# Altium project PCB_Project1.PrjPCB
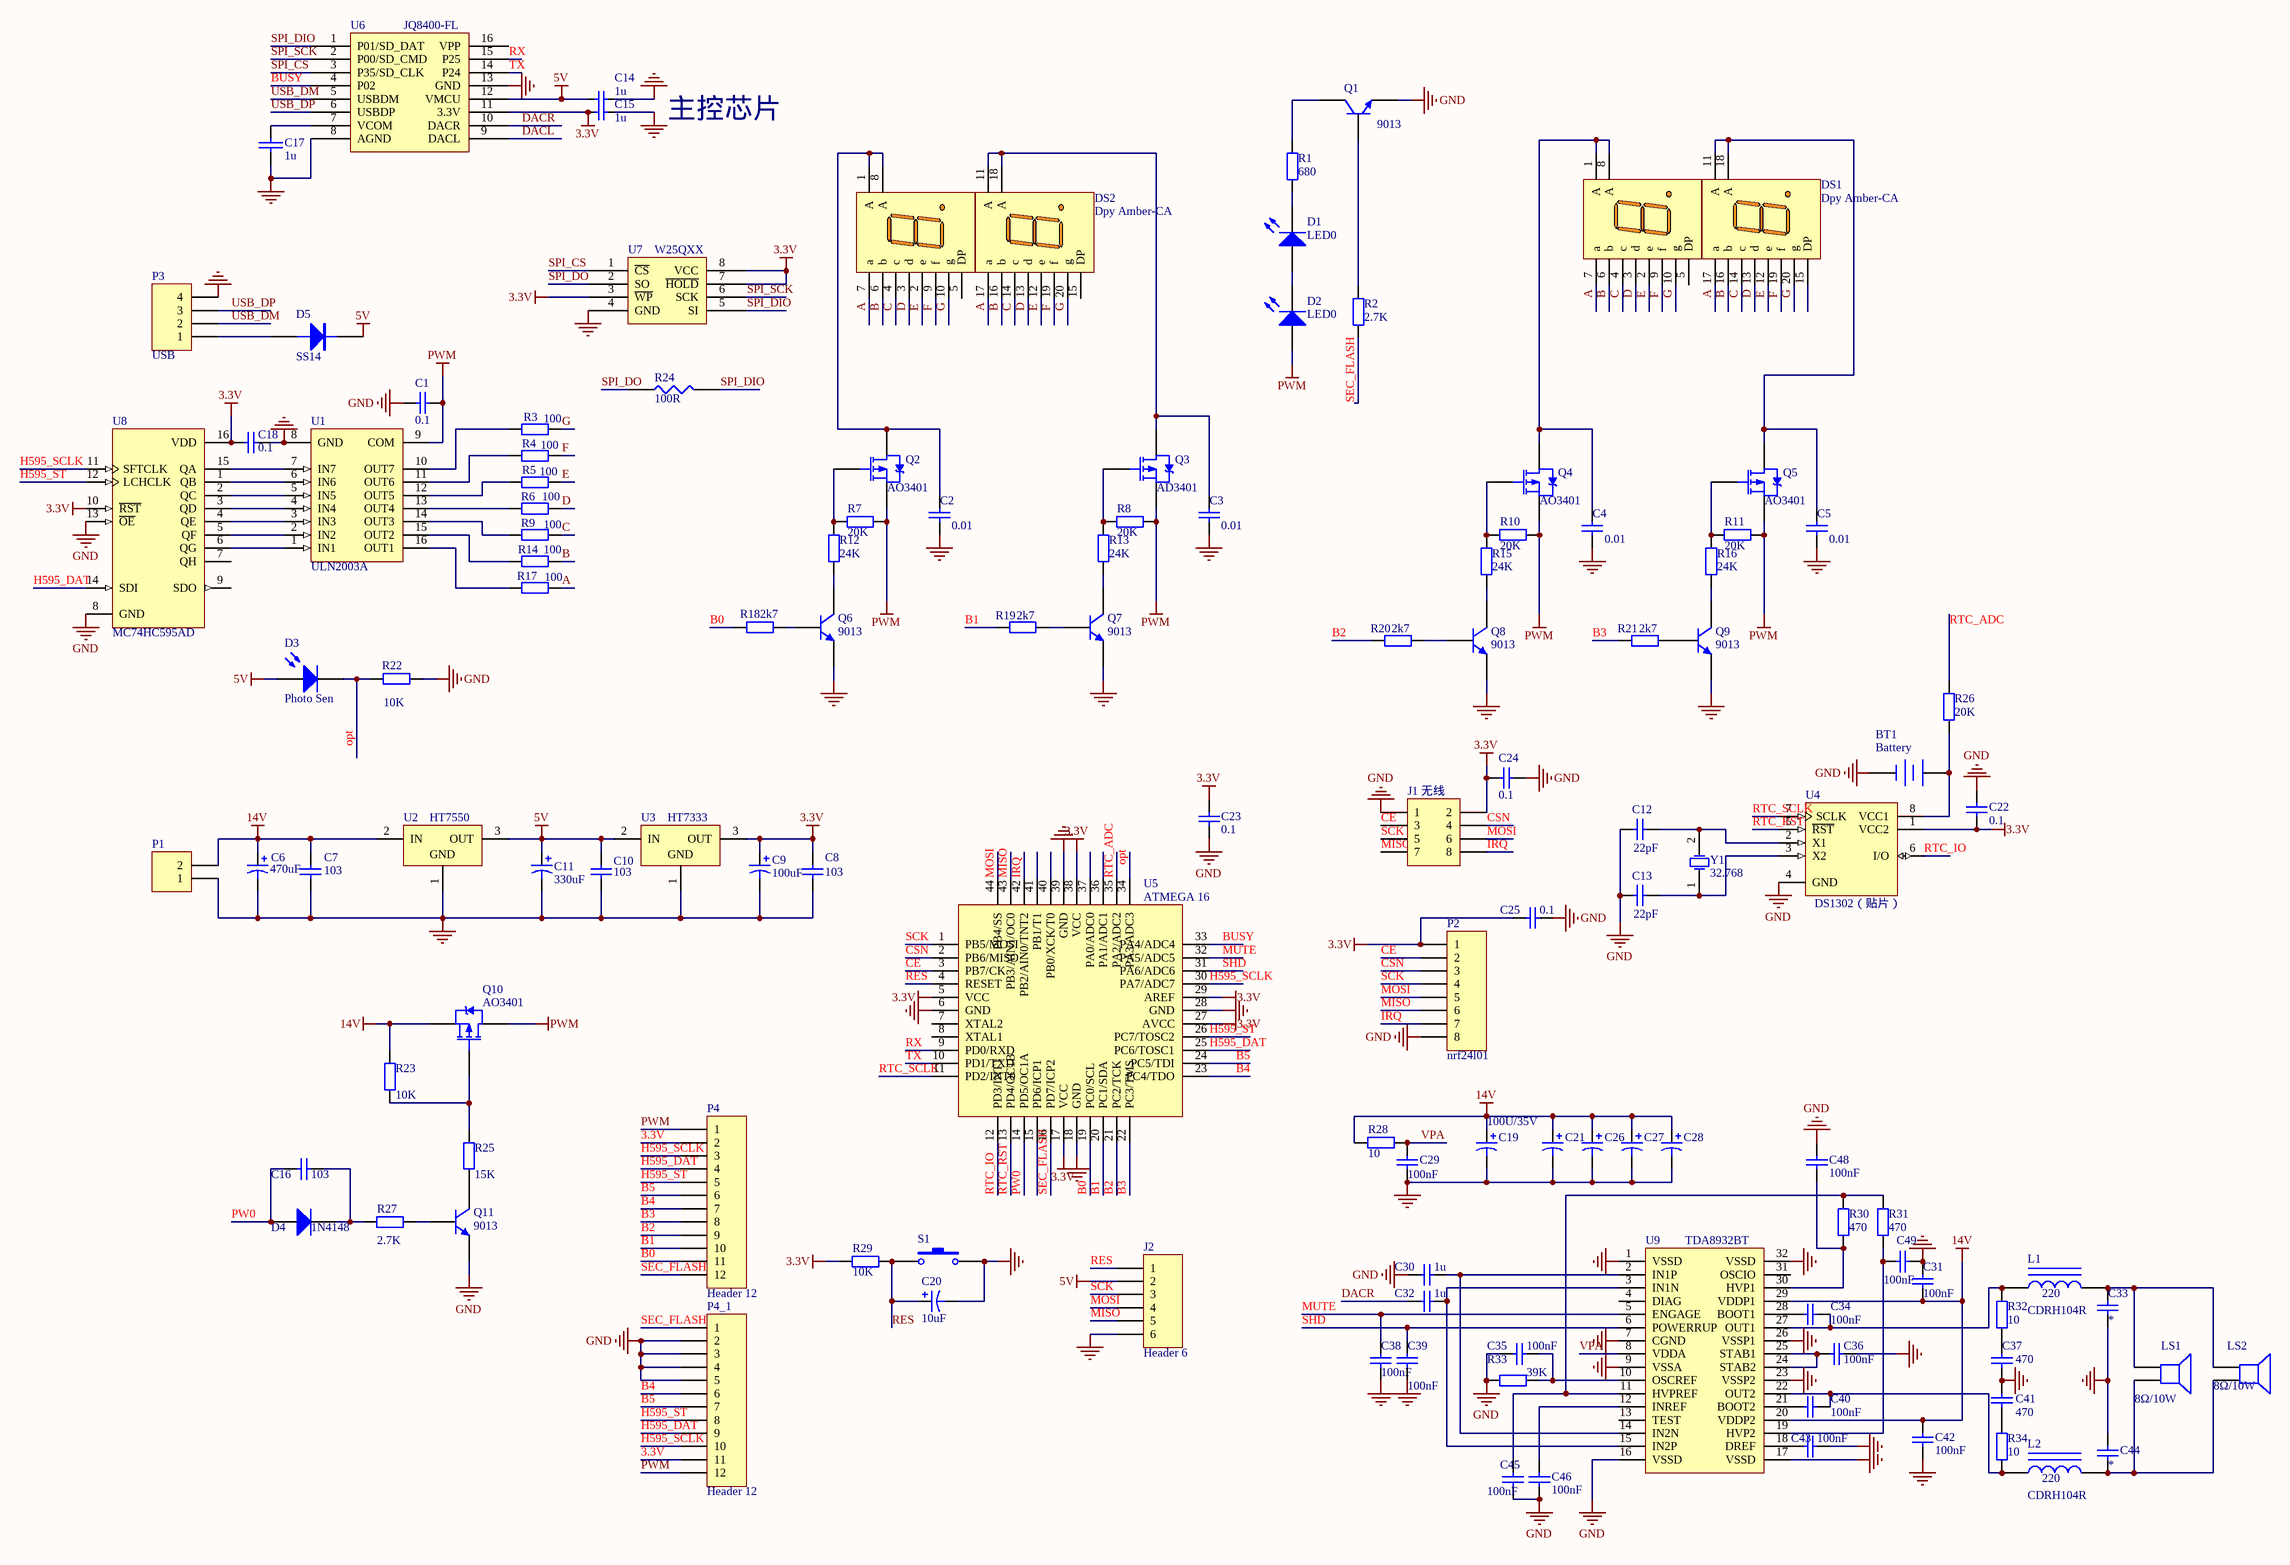
[diagram p0: Sheet1.SchDoc]
1 sheet, 123 parts. Net scope: global (net labels, ports and power ports of the same name join across sheets).
Board file: PCB1.PcbDoc

## Sheet Sheet1.SchDoc
size A2; PageSetup: Record=PageOptions|CenterHorizontal=True|CenterVertical=True|PrintScale=0.50|XCorrection=1.00|YCorrection=1.00|PrintKind=2|BorderSize=5000000|LeftOffset=0|BottomOffset=0|Orientation=2|PaperLength=1000|PaperWidth=1000|Scale=100|PaperSource=7|PrintQuality=-4|MediaType=1|DitherType=10|PaperKind=A4|PrintScaleMode=1

### Parts
BT1  Battery  [1220电池底座]
C1  0.1  [0805]
C2  value 0.01  [0805]  (hidden comment: 0.1)
C3  value 0.01  [0805]  (hidden comment: 0.1)
C4  value 0.01  [0805]  (hidden comment: 0.1)
C5  value 0.01  [0805]  (hidden comment: 0.1)
C6  value 470uF  [470uf35V贴片]  (hidden comment: Cap Pol1)
C7  value 103  [0805]  (hidden comment: Cap Semi)
C8  value 103  [0805]  (hidden comment: Cap Semi)
C9  value 100uF  [1206]  (hidden comment: Cap Pol1)
C10  value 103  [0805]  (hidden comment: Cap Semi)
C11  value 330uF  [220uf16V贴片]  (hidden comment: Cap Pol1)
C12  value 22pF  [0805]  (hidden comment: Cap)
C13  value 22pF  [0805]  (hidden comment: Cap)
C14  1u  [0805]
C15  1u  [0805]
C16  value 103  [0805]  (hidden comment: Cap Semi)
C17  1u  [0805]
C18  0.1  [0805]
C19  100U/35V  [220uf16V贴片]
C20  value 10uF  [1206]
C21  Cap Pol1  [220uf16V贴片]  (value not drawn)
C22  0.1  [0805]
C23  0.1  [0805]
C24  0.1  [0805]
C25  0.1  [0805]
C26  Cap Pol1  [220uf16V贴片]  (value not drawn)
C27  Cap Pol1  [220uf16V贴片]  (value not drawn)
C28  Cap Pol1  [220uf16V贴片]  (value not drawn)
C29  value 100nF  [0603]  (hidden comment: 0.1)
C30  value 1u  [0603]  (hidden comment: 0.1)
C31  value 100nF  [0603]  (hidden comment: 0.1)
C32  value 1u  [0603]  (hidden comment: 0.1)
C33  0.1  [0805]  (value not drawn)
C34  value 100nF  [0603]  (hidden comment: 0.1)
C35  value 100nF  [0603]  (hidden comment: 0.1)
C36  value 100nF  [0603]  (hidden comment: 0.1)
C37  value 470  [0603]  (hidden comment: 0.1)
C38  value 100nF  [0603]  (hidden comment: 0.1)
C39  value 100nF  [0603]  (hidden comment: 0.1)
C40  value 100nF  [0603]  (hidden comment: 0.1)
C41  value 470  [0603]  (hidden comment: 0.1)
C42  value 100nF  [0603]  (hidden comment: 0.1)
C43  value 100nF  [0603]  (hidden comment: 0.1)
C44  0.1  [0805]  (value not drawn)
C45  value 100nF  [0603]  (hidden comment: 0.1)
C46  value 100nF  [0603]  (hidden comment: 0.1)
C48  value 100nF  [0603]  (hidden comment: 0.1)
C49  value 100nF  [0603]  (hidden comment: 0.1)
D1  LED0  [led]
D2  LED0  [led]
D3  Photo Sen  [2排针]
D4  1N4148  [1206]
D5  SS14  [1206]
DS1  Dpy Amber-CA  [5英寸数码管]
DS2  Dpy Amber-CA  [5英寸数码管]
J1  无线  [无线模块]
J2  Header 6  [HDR1X6]
L1  220  value CDRH104R  [CDRH104]
L2  220  value CDRH104R  [CDRH104]
LS1  8Ω/10W  [2排针]
LS2  8Ω/10W  [2排针]
P1  Header 2  [电源插头]  (value not drawn)
P2  nrf24l01  [24L01]
P3  USB  [HDR1X4]
P4  Header 12  [FPC-12P1MM]
P4_1  Header 12  [FPC-12P1MM]
Q1  9013  [9013贴片（专用）]
Q2  AO3401  [SOP-23]
Q3  AD3401  [SOP-23]
Q4  AO3401  [SOP-23]
Q5  AO3401  [SOP-23]
Q6  9013  [9013贴片（专用）]
Q7  9013  [9013贴片（专用）]
Q8  9013  [9013贴片（专用）]
Q9  9013  [9013贴片（专用）]
Q10  AO3401  [SOP-23]
Q11  9013  [9013贴片（专用）]
R1  value 680  [0805]  (hidden comment: Res2)
R2  value 2.7K  [0805]  (hidden comment: Res2)
R3  100  [0805]
R4  100  [0805]
R5  100  [0805]
R6  100  [0805]
R7  20K  [0805]
R8  20K  [0805]
R9  100  [0805]
R10  20K  [0805]
R11  20K  [0805]
R12  24K  [0805]
R13  24K  [0603]
R14  100  [0805]
R15  24K  [0805]
R16  24K  [0805]
R17  100  [0805]
R18  2k7  [0805]
R19  2k7  [0805]
R20  2k7  [0805]
R21  2k7  [0805]
R22  value 10K  [0805]
R23  value 10K  [0805]  (hidden comment: Res2)
R24  100R
R25  value 15K  [0805]  (hidden comment: Res2)
R26  20K  [0805]
R27  value 2.7K  [0805]  (hidden comment: Res2)
R28  10  [0805]
R29  value 10K  [0805]
R30  470  [0603]
R31  470  [0603]
R32  10  [0603]
R33  39K  [0603]
R34  10  [0603]
S1  (no value)  [4脚按键]
U1  ULN2003A  [SO-16]
U2  HT7550  [SOT89L]
U3  HT7333  [SOT89L]
U4  DS1302（贴片）  [SOP8（DS1302）]
U5  ATMEGA 16  [44贴片（顶层）]
U6  JQ8400-FL  [SO-16]
U7  W25QXX  [w25]
U8  MC74HC595AD  [751B-05_N]
U9  TDA8932BT  [SOIC127P1047-32L]
Y1  32.768  [32K]

### Nets
3.3V: C8.2 C9.1 C15.1 C18.2 C22.1 C23.1 C24.1 C25.1 J1.2 P2.1 P4.2 P4_1.11 R29.1 U3.3(OUT) U4.1(VCC2) U5.5(VCC) U5.17(VCC) U5.27(AVCC) U5.29(AREF) U5.38(VCC) U6.11(3.3V) U7.3(~{WP}) U7.7(~{HOLD}) U7.8(VCC) U8.10(~{RST}) U8.16(VDD)
5V: C10.2 C11.1 C14.1 D3.1(A) D5.2(K) J2.2 U2.3(OUT) U3.2(IN) U6.12(VMCU)
14V: C6.1 C7.2 C19.1 C21.1 C26.1 C27.1 C28.1 C31.1 C42.1 P1.2 Q10.3(S) R23.2 R28.1 U2.2(IN) U9.20(VDDP2) U9.29(VDDP1)
GND: BT1.2(-) C1.2 C2.1 C3.1 C4.1 C5.1 C6.2 C7.1 C8.1 C9.2 C10.1 C11.2 C12.1 C13.1 C14.2 C15.2 C17.2 C18.1 C19.2 C20.2 C21.2 C22.2 C23.2 C24.2 C25.2 C26.2 C27.2 C28.2 C29.1 C30.1 C31.2 C33.2 C35.1 C36.1 C37.2 C38.1 C39.1 C41.2 C42.2 C43.1 C44.1 C45.1 C46.1 C48.2 C49.1 J1.1 J2.6 P1.1 P2.8 P3.4 P4_1.2 P4_1.3 P4_1.4 P4_1.5 Q1.1(E) Q6.2(E) Q7.2(E) Q8.2(E) Q9.2(E) Q11.1(E) R22.1 R33.2 S1.2 U1.8(GND) U2.1(GND) U3.1(GND) U4.4(GND) U5.6(GND) U5.18(GND) U5.28(GND) U5.39(GND) U6.8(AGND) U6.13(GND) U7.4(GND) U8.8(GND) U8.13(~{OE}) U9.1(VSSD) U9.7(CGND) U9.9(VSSA) U9.16(VSSD) U9.17(VSSD) U9.23(VSSP2) U9.26(VSSP1) U9.32(VSSD)
PWM: C1.1 D2.1(A) P4.1 P4_1.12 Q2.2(S) Q3.2(S) Q4.2(S) Q5.2(S) Q10.2(D) R7.1 R8.1 R10.1 R11.1 U1.9(COM)
A: DS1.7(a) DS1.17(a) DS2.7(a) DS2.17(a) R17.1
B: DS1.6(b) DS1.16(b) DS2.6(b) DS2.16(b) R14.1
B0: P4.11 R18.2 U5.19(PC0/SCL)
B1: P4.10 R19.2 U5.20(PC1/SDA)
B2: P4.9 R20.2 U5.21(PC2/TCK)
B3: P4.8 R21.2 U5.22(PC3/TMS)
B4: P4.7 P4_1.6 U5.23(PC4/TDO)
B5: P4.6 P4_1.7 U5.24(PC5/TDI)
BUSY: U5.33(PA4/ADC4) U6.4(P02)
C: DS1.4(c) DS1.14(c) DS2.4(c) DS2.14(c) R9.1
CE: J1.3 P2.2 U5.3(PB7/CK)
CSN: J1.4 P2.3 U5.2(PB6/MISO)
D: DS1.3(d) DS1.13(d) DS2.3(d) DS2.13(d) R6.1
DACL: U6.9(DACL)
DACR: C32.1 U6.10(DACR)
E: DS1.2(e) DS1.12(e) DS2.2(e) DS2.12(e) R5.1
F: DS1.9(f) DS1.19(f) DS2.9(f) DS2.19(f) R4.1
G: DS1.10(g) DS1.20(g) DS2.10(g) DS2.20(g) R3.1
H595_DAT: P4.4 P4_1.9 U5.25(PC6/TOSC1) U8.14(SDI)
H595_SCLK: P4.3 P4_1.10 U5.30(PA7/ADC7) U8.11(SFTCLK)
H595_ST: P4.5 P4_1.8 U5.26(PC7/TOSC2) U8.12(LCHCLK)
IRQ: J1.8 P2.7 U5.42(PB2/AIN0/TNT2)
MISO: J1.7 J2.5 P2.6 U5.43(PB3/AIN1/OC0)
MOSI: J1.6 J2.4 P2.5 U5.44(PB4/SS)
MUTE: C38.2 U5.32(PA5/ADC5) U9.5(ENGAGE)
opt: D3.2(K) R22.2 U5.34(PA3/ADC3)
PW0: C16.2 D4.1(A) U5.14(PD5/OC1A)
RES: C20.1 J2.1 R29.2 S1.1 U5.4(RESET)
RTC_ADC: R26.1 U5.35(PA2/ADC2)
RTC_IO: U4.6(I/O) U5.12(PD3/INT1)
RTC_RST: U4.5(~{RST}) U5.13(PD4/OC1B)
RTC_SCLK: U4.7(SCLK) U5.11(PD2/INT0)
RX: U5.9(PD0/RXD) U6.15(P25)
SCK: J1.5 J2.3 P2.4 U5.1(PB5/MOSI)
SEC_FLASH: P4.12 P4_1.1 R2.1 U5.16(PD7/ICP2)
SHD: C39.2 U5.31(PA6/ADC6) U9.6(POWERRUP)
SPI_CS: U6.3(P35/SD_CLK) U7.1(~{CS})
SPI_DIO: R24.2 U6.1(P01/SD_DAT) U7.5(SI)
SPI_DO: R24.1 U7.2(SO)
SPI_SCK: U6.2(P00/SD_CMD) U7.6(SCK)
TX: U5.10(PD1/TXD) U6.14(P24)
USB_DM: P3.2 U6.5(USBDM)
USB_DP: P3.3 U6.6(USBDP)
VPA: C29.2 R28.2 U9.8(VDDA)
NetBT1_1: BT1.1(+) R26.2 U4.8(VCC1)
NetC2_2: C2.2 DS2.1(A) DS2.8(A) Q2.3(D)
NetC3_2: C3.2 DS2.11(A) DS2.18(A) Q3.3(D)
NetC4_2: C4.2 DS1.1(A) DS1.8(A) Q4.3(D)
NetC5_2: C5.2 DS1.11(A) DS1.18(A) Q5.3(D)
NetC12_2: C12.2 U4.2(X1) Y1.2(OSC2)
NetC13_2: C13.2 U4.3(X2) Y1.1(OSC1)
NetC16_1: C16.1 D4.2(K) R27.2
NetC17_1: C17.1 U6.7(VCOM)
NetC30_2: C30.2 U9.2(IN1P) U9.14(IN2N)
NetC32_2: C32.2 U9.3(IN1N) U9.15(IN2P)
NetC33_1: C33.1 L1.2 LS1.1 LS2.2
NetC34_1: C34.1 L1.1 R32.1 U9.27(OUT1)
NetC34_2: C34.2 U9.28(BOOT1)
NetC35_2: C35.2 R33.1 U9.10(OSCREF)
NetC36_2: C36.2 U9.24(STAB2) U9.25(STAB1)
NetC37_1: C37.1 R32.2
NetC40_1: C40.1 L2.1 R34.1 U9.22(OUT2)
NetC40_2: C40.2 U9.21(BOOT2)
NetC41_1: C41.1 R34.2
NetC43_2: C43.2 U9.18(DREF)
NetC44_2: C44.2 L2.2 LS1.2 LS2.1
NetC45_2: C45.2 R30.1 R31.1 U9.11(HVPREF)
NetC46_2: C46.2 U9.12(INREF)
NetC48_1: C48.1 R30.2 U9.30(HVP1)
NetC49_2: C49.2 R31.2 U9.19(HVP2)
NetD1_1: D1.1(A) D2.2(K)
NetD1_2: D1.2(K) R1.1
NetD5_1: D5.1(A) P3.1
NetQ1_2: Q1.2(B) R2.2
NetQ1_3: Q1.3(C) R1.2
NetQ2_1: Q2.1(G) R7.2 R12.1
NetQ3_1: Q3.1(G) R8.2 R13.1
NetQ4_1: Q4.1(G) R10.2 R15.1
NetQ5_1: Q5.1(G) R11.2 R16.1
NetQ6_1: Q6.1(B) R18.1
NetQ6_3: Q6.3(C) R12.2
NetQ7_1: Q7.1(B) R19.1
NetQ7_3: Q7.3(C) R13.2
NetQ8_1: Q8.1(B) R20.1
NetQ8_3: Q8.3(C) R15.2
NetQ9_1: Q9.1(B) R21.1
NetQ9_3: Q9.3(C) R16.2
NetQ10_1: Q10.1(G) R23.1 R25.2
NetQ11_2: Q11.2(B) R27.1
NetQ11_3: Q11.3(C) R25.1
NetR3_2: R3.2 U1.10(OUT7)
NetR4_2: R4.2 U1.11(OUT6)
NetR5_2: R5.2 U1.12(OUT5)
NetR6_2: R6.2 U1.13(OUT4)
NetR9_2: R9.2 U1.14(OUT3)
NetR14_2: R14.2 U1.15(OUT2)
NetR17_2: R17.2 U1.16(OUT1)
NetU1_1: U1.1(IN1) U8.6(QG)
NetU1_2: U1.2(IN2) U8.5(QF)
NetU1_3: U1.3(IN3) U8.4(QE)
NetU1_4: U1.4(IN4) U8.3(QD)
NetU1_5: U1.5(IN5) U8.2(QC)
NetU1_6: U1.6(IN6) U8.1(QB)
NetU1_7: U1.7(IN7) U8.15(QA)

Not connected (* = marked no-connect by the designer): DS1 5(DP) 15(DP); DS2 5(DP) 15(DP); U5 7(XTAL2) 8(XTAL1) 15(PD6/ICP1) 36(PA1/ADC1) 37(PA0/ADC0) 40(PB0/XCK/T0) 41(PB1/T1); U6 16(VPP); U8 7(QH) 9(SDO); U9 4(DIAG) 13(TEST) 31(OSCIO)

### Notes on the sheet
- 主控芯片

### Library data of the parts
BT1 = Battery: Multicell Battery; Published: 24-Mar-1999; LatestRevisionDate: 17-Jul-2002; LatestRevisionNote: Re-released for DXP Platform.; PackageReference: BAT-2; Publisher: Altium Limited; PackageDescription: Battery; 2 Leads
C1-C5 C12 C13 C18 C22-C25 C29-C46 C48 C49 = Cap: Capacitor; Published: 8-Jun-2000; LatestRevisionDate: 17-Jul-2002; LatestRevisionNote: Re-released for DXP Platform.; PackageReference: RAD-0.3; Publisher: Altium Limited
  C1 C18 C22-C25: Value: 0.1
  C33 C44: Value: *
C6 C9 C11 = Cap Pol1: Polarized Capacitor (Radial); Published: 8-Jun-2000; LatestRevisionDate: 17-Jul-2002; LatestRevisionNote: Re-released for DXP Platform.; PackageReference: RB7.6-15; Publisher: Altium Limited
C7 C8 C10 C16 = Cap Semi: Capacitor (Semiconductor SIM Model); Published: 8-Jun-2000; LatestRevisionDate: 29-May-2009; LatestRevisionNote: IPC-7351 Footprint Added.; PackageReference: C1206; Publisher: Altium Limited; PackageDescription: Chip Capacitor
C14 C15 C17 = CAP: Capacitor
C19 C21 C26-C28 = Cap Pol1: Polarized Capacitor (Radial); Value: 100uF/35V; Published: 8-Jun-2000; LatestRevisionDate: 17-Jul-2002; LatestRevisionNote: Re-released for DXP Platform.; PackageReference: RB7.6-15; Publisher: Altium Limited
C20 = Cap Pol3: Polarized Capacitor (Surface Mount); Published: 8-Jun-2000; LatestRevisionDate: 29-May-2009; LatestRevisionNote: IPC-7351 Footprint Added.; PackageReference: C0805; Publisher: Altium Limited; PackageDescription: Chip Capacitor
D1 D2 = LED0: Typical INFRARED GaAs LED; Published: 8-Jun-2000; LatestRevisionDate: 08-Jul-2005; LatestRevisionNote: Mech Layer 1 removed.; PackageReference: LED-0; Publisher: Altium Limited
D3 = Photo Sen: Photosensitive Diode; Published: 24-Mar-1999; LatestRevisionDate: 17-Jul-2002; LatestRevisionNote: Re-released for DXP Platform.; PackageReference: PIN2; Publisher: Altium Limited
D4 = Diode 1N4007: 1 Amp General Purpose Rectifier; Published: 8-Jun-2000; LatestRevisionDate: 17-Jul-2002; LatestRevisionNote: Re-released for DXP Platform.; DatasheetVersion: 1998; PackageVersion: Aug-1999; PackageReference: DO-41; Publisher: Altium Limited; PackageDescription: Diode, Axial; Body 5.2 x 2.7 mm (LxDia. max), Lead Dia. 0.86 mm (max); Code_JEDEC: DO-204-AL; ComponentLink1Description: Manufacturer Link; ComponentLink1URL: http://www.fairchildsemi.com/; ComponentLink2Description: Datasheet; ComponentLink2URL: http://www.fairchildsemi.com/ds/1N%2F1N4001.pdf
D5 = DIODE
DS1 DS2 = Dpy Amber-CA: 7.62 mm Black Surface Orange 7-Segment Display: CA, RH DP; MinimumIntensity: 354 ucd; Note: IF = 5 mA; Note: Pins 1 and 6 are redundant Anodes.; Published: 8-Jun-2000; LatestRevisionDate: 17-Dec-2003; LatestRevisionNote: Schematic revised, PCB Footprint replaced.; DatasheetVersion: 19-Feb-2002; PackageVersion: 19-Feb-2002; PackageReference: LEDDIP-10; Publisher: Altium Limited; Colour: Orange; ComponentLink1Description: Manufacturer Link; ComponentLink1URL: http://www.agilent.com/
J1 = Header 4X2: Header, 4-Pin, Dual row; LatestRevisionDate: 17-Jul-2002; LatestRevisionNote: Re-released for DXP Platform.; Publisher: Altium Limited
J2 = Header 6: Header, 6-Pin; LatestRevisionDate: 17-Jul-2002; LatestRevisionNote: Re-released for DXP Platform.; Publisher: Altium Limited
L1 L2 = Inductor Iron: Magnetic-Core Inductor; Published: 24-Mar-1999; LatestRevisionDate: 17-Jul-2002; LatestRevisionNote: Re-released for DXP Platform.; PackageReference: AXIAL-0.9; Publisher: Altium Limited
LS1 LS2 = Speaker: Loudspeaker; Published: 24-Mar-1999; LatestRevisionDate: 17-Jul-2002; LatestRevisionNote: Re-released for DXP Platform.; PackageReference: PIN2; Publisher: Altium Limited
P1 = Header 2: Header, 2-Pin; LatestRevisionDate: 17-Jul-2002; LatestRevisionNote: Re-released for DXP Platform.; Publisher: Altium Limited
P2 = Header 8: Header, 8-Pin; LatestRevisionDate: 17-Jul-2002; LatestRevisionNote: Re-released for DXP Platform.; Publisher: Altium Limited
P3 = Header 4: Header, 4-Pin; LatestRevisionDate: 17-Jul-2002; LatestRevisionNote: Re-released for DXP Platform.; Publisher: Altium Limited
P4 P4_1 = Header 12: Header, 12-Pin; LatestRevisionDate: 17-Jul-2002; LatestRevisionNote: Re-released for DXP Platform.; Publisher: Altium Limited
Q1 Q6-Q9 Q11 = 2N3904: NPN General Purpose Amplifier; Published: 8-Jun-2000; LatestRevisionDate: 15-Jan-2003; LatestRevisionNote: PCB Footprint 'BCY-W3/D4.7' replaced; DatasheetVersion: 1997; PackageVersion: Sep-1998; PackageReference: TO-92A; Publisher: Altium Limited; ComponentLink1Description: Manufacturer Link; ComponentLink1URL: http://www.fairchildsemi.com/; ComponentLink2Description: Datasheet; ComponentLink2URL: http://www.fairchildsemi.com/ds/2N%2F2N3904.pdf
  Q1 Q11: PackageDescription: TO, Flat Index; 3 In-Line, Axial Leads; Body Dia. 4.5mm; Leads 0.51 x 0.48 mm (max)
  Q6-Q9: Code_JEDEC: TO-92A
Q2-Q5 Q10 = PMOS-2: P-Channel Power MOSFET; Note: Pin 4 not drawn and electrically connected to Pin 2.; Published: 8-Jun-2000; LatestRevisionDate: 17-Jul-2002; LatestRevisionNote: Re-released for DXP Platform.; DatasheetVersion: PD-9.390D; PackageReference: TO-220AB; Publisher: Altium Limited; ComponentLink1Description: Manufacturer Link; ComponentLink1URL: http://www.irf.com/
  Q2-Q5: Code_JEDEC: TO-220-AB
  Q10: PackageVersion: Feb-1997; PackageDescription: TO, Thru-Hole, Vertical, Heatsink Mounted; 3 In-Line Leads; Pitch 2.54 mm
R1 R2 R4-R6 R22 R23 R25 R27 R29 = Res2: Resistor; Published: 8-Jun-2000; LatestRevisionDate: 17-Jul-2002; LatestRevisionNote: Re-released for DXP Platform.; PackageReference: AXIAL-0.4; Publisher: Altium Limited
  R4-R6: Value: 100
  R23 R25 R27: PackageDescription: Axial Device, Thru-Hole; 2 Leads; 0.4 in Pin Spacing
R3 R9 R14 R17-R21 = Res2: Resistor; Value: 47; Published: 8-Jun-2000; LatestRevisionDate: 17-Jul-2002; LatestRevisionNote: Re-released for DXP Platform.; PackageReference: AXIAL-0.4; Publisher: Altium Limited
R7 R8 R10-R13 R15 R16 R26 R28 R30-R34 = Res2: Resistor; Value: 5K; Published: 8-Jun-2000; LatestRevisionDate: 17-Jul-2002; LatestRevisionNote: Re-released for DXP Platform.; PackageReference: AXIAL-0.4; Publisher: Altium Limited
R24 = RES1
S1 = SW-PB: Switch; Published: 24-Mar-1999; LatestRevisionDate: 17-Jul-2002; LatestRevisionNote: Re-released for DXP Platform.; PackageReference: SPST-2; Publisher: Altium Limited
U1 = ULN2003A: High-Voltage, High-Current Darlington Array; Published: 13-Oct-2000; LatestRevisionDate: 06-Jun-2005; LatestRevisionNote: Stylized 3D Model Added.; DatasheetVersion: 1998; PackageVersion: 1998; PackageReference: A16; Publisher: Altium Limited; PackageDescription: DIP; 16 Leads; Row Spacing 7.62 mm; Pitch 2.54 mm; Code_JEDEC: MS-001-BB; ComponentLink1Description: Manufacturer Link; ComponentLink1URL: http://www.allegromicro.com/
U2 U3 = HT7530-1: 3.0V 100mA Low Power,  Low Dropout Voltage (LDO) Regulator; Published: 30-Mar-2007; DatasheetVersion: rev1.50, Jan-2006; PackageVersion: Jan-2006; PackageReference: SOT-89; Publisher: Altium Limited; PackageDescription: 3-Pin SOT-89 Package 1.5 mm Pitch, 4.1 mm Lead Span; Code_IPC: SOT89; ComponentLink1Description: Manufacturer Link; ComponentLink1URL: http://www.holtek.com/; ComponentLink2Description: Datasheet; ComponentLink2URL: http://www.holtek.com/pdf/consumer/75xx_1v150.pdf
U4 = DS1302: Trickle Charge Timekeeping Chip; Published: 13-Oct-2000; LatestRevisionDate: 06-Jun-2005; LatestRevisionNote: Stylized 3D Model Added.; DatasheetVersion: 2-Jul-1999; PackageVersion: 1999; PackageReference: DIP8; Publisher: Altium Limited; PackageDescription: DIP; 8 Leads; Row Spacing 7.62 mm; Pitch 2.54 mm; ComponentLink1Description: Manufacturer Link; ComponentLink1URL: http://www.maxim-ic.com/; ComponentLink2Description: Datasheet; ComponentLink2URL: http://pdfserv.maxim-ic.com/en/ds/DS1302.pdf
U6 = W6082
U8 = MC74HC595AD: 8-Bit Serial-Input/Serial or Prallel-Output Shift Register with Latched 3-State Outputs; Published: 15-Apr-2002; LatestRevisionDate: 13-Apr-2006; LatestRevisionNote: IPC-7351 Footprint Added.; DatasheetVersion: Mar-2000; PackageVersion: Oct-1999; PackageReference: 751B-05; Publisher: Altium Limited; PackageDescription: 16-Pin Small Outline Integrated Circuit 1.27 mm Pitch; Code_JEDEC: MS-012-AC; Code_IPC: SOIC127P600-16; ComponentLink1Description: Manufacturer Link; ComponentLink1URL: http://www.onsemi.com/; ComponentLink2Description: Datasheet; ComponentLink2URL: http://www.onsemi.com/pub/Collateral/MC74HC595A-D.PDF
U9 = TDA8932
Y1 = XTAL: Crystal Oscillator; Published: 8-Jun-2000; LatestRevisionDate: 17-Jul-2002; LatestRevisionNote: Re-released for DXP Platform.; PackageReference: R38; Publisher: Altium Limited